# EasyEDA schematic ads1115-reference.easyeda.json

## Sheets
1 ADC logic: TITLE: Lunatic MIDI: ADC logic module; REV: 1.0; Date: 2019-02-11; Sheet: 1/1; Drawn By: Marco Zaccari
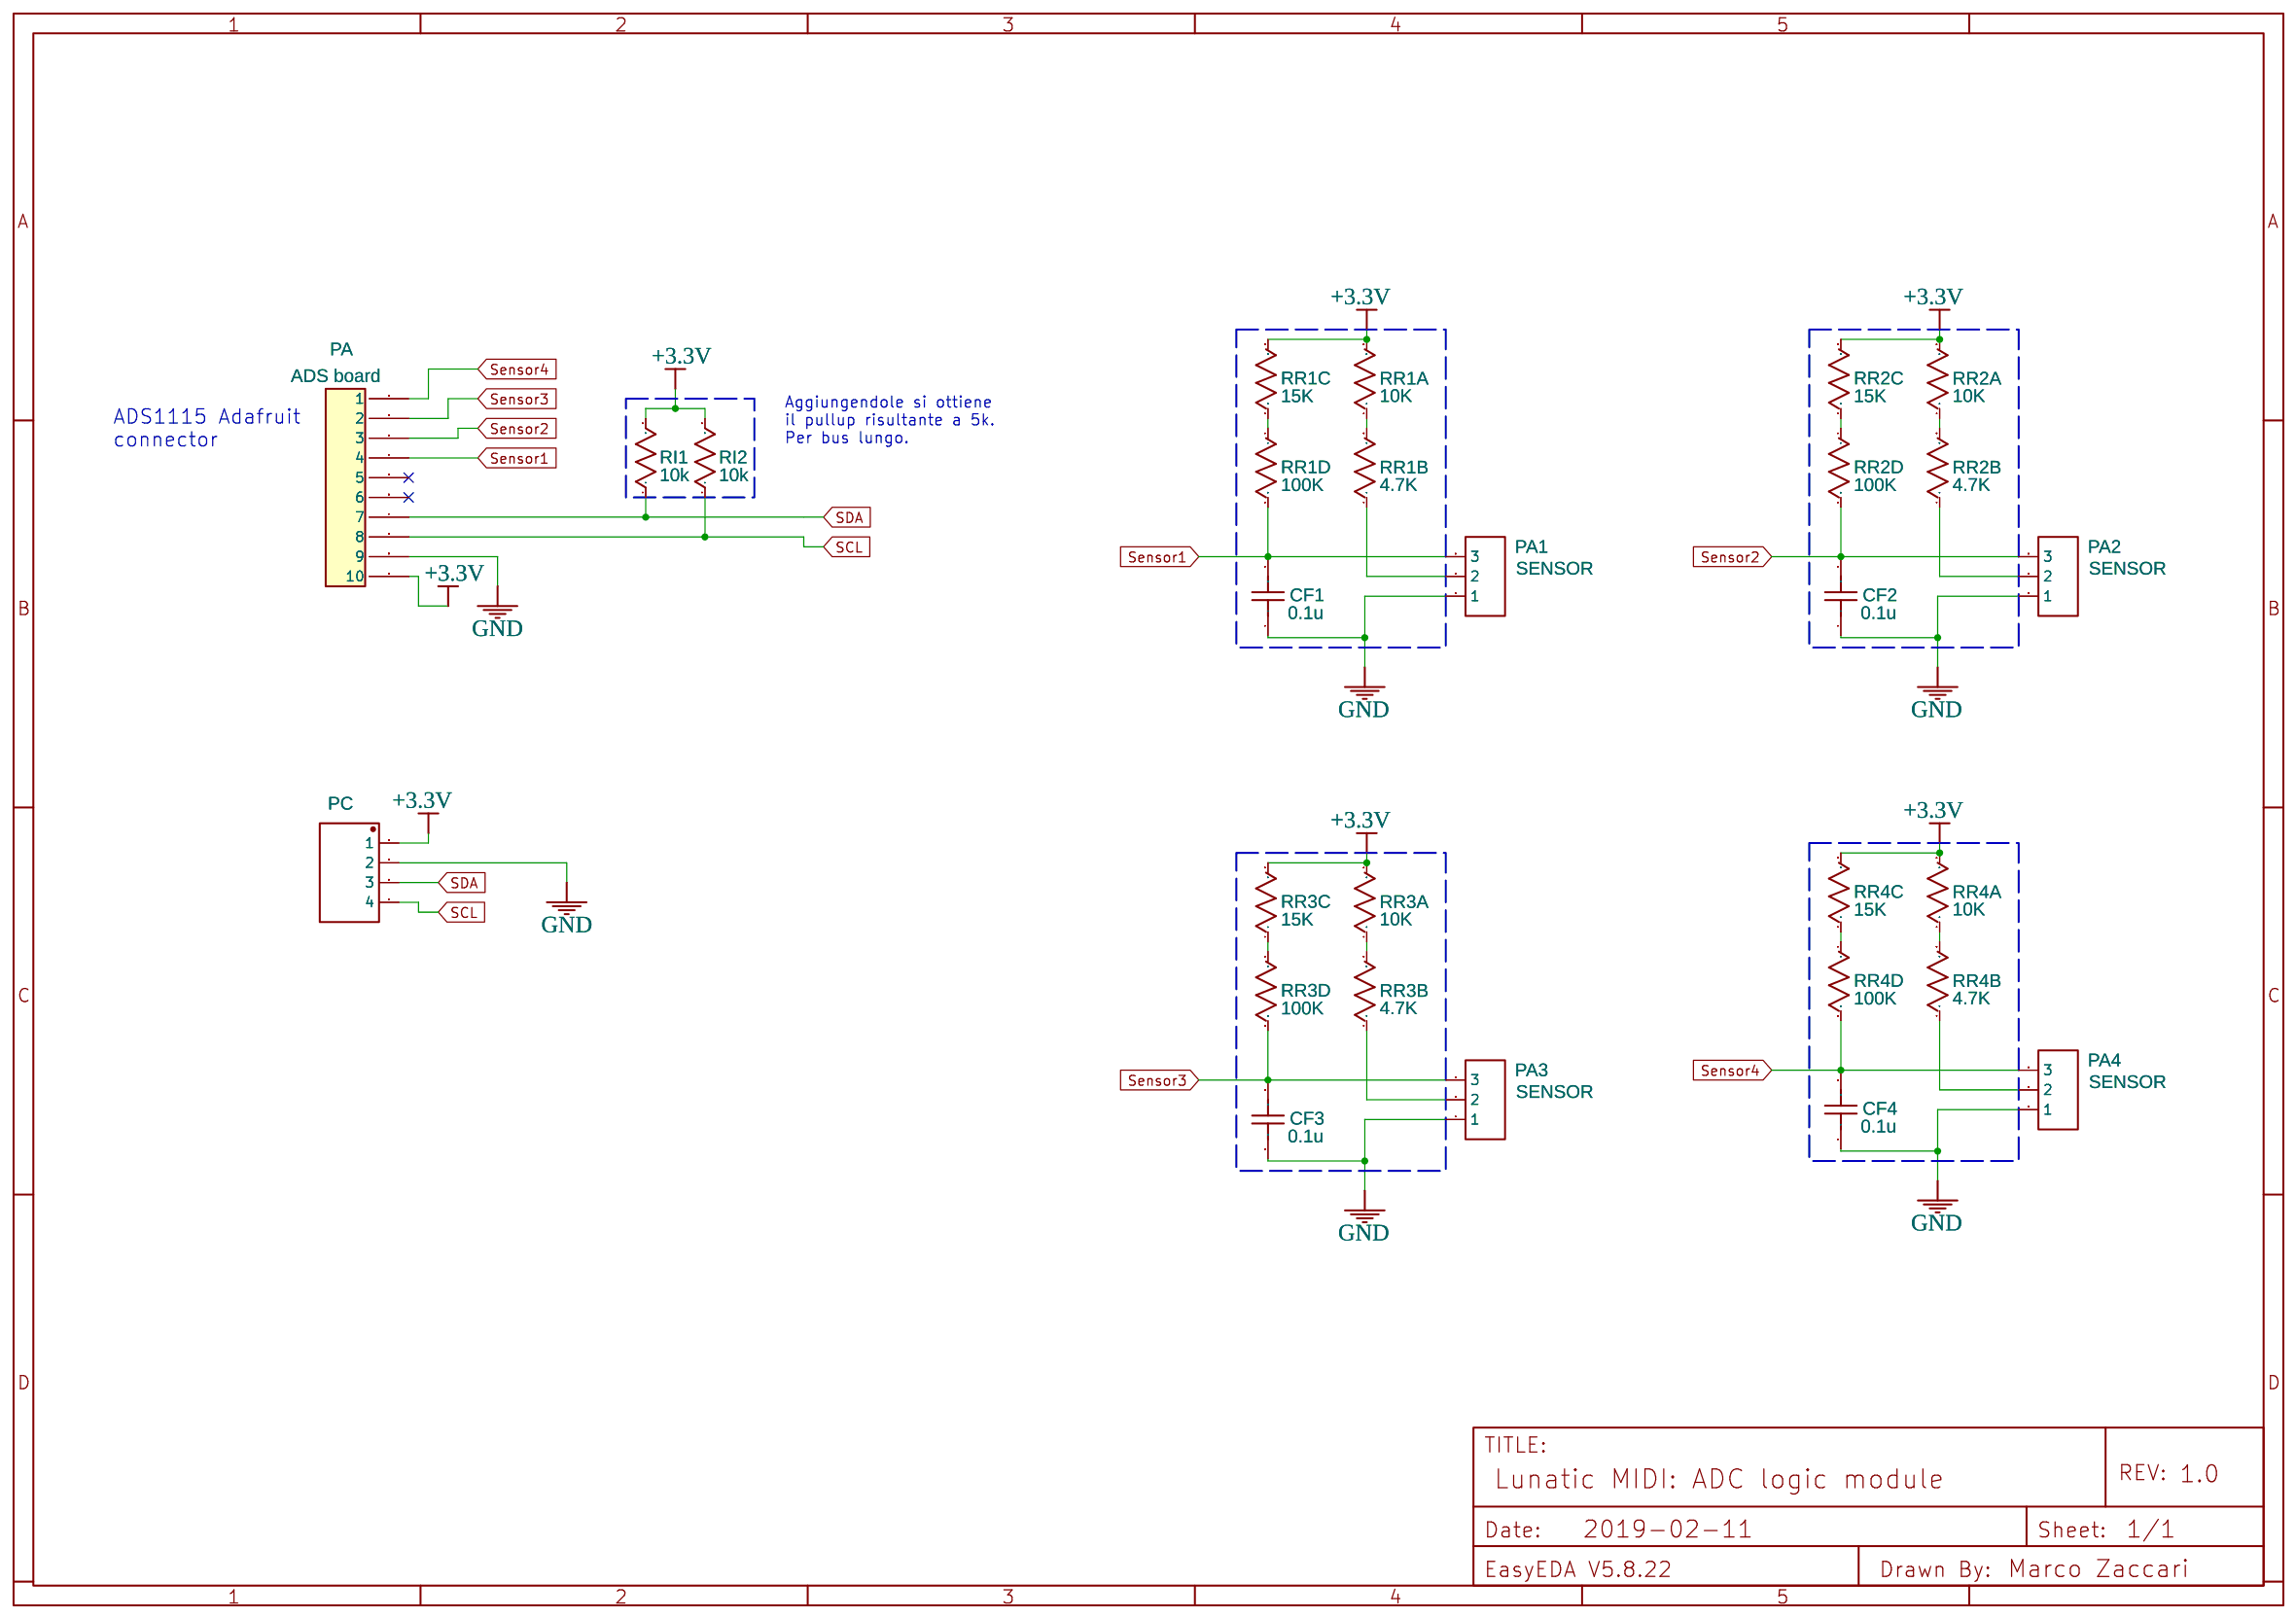
[diagram p0: ADC logic]
2 ADS1115 Adafruit and Ribbon (reference): TITLE: ADS1115 Adafruit and Ribbon reference; Date: 2021-04-03; Drawn By: Mark Zackie
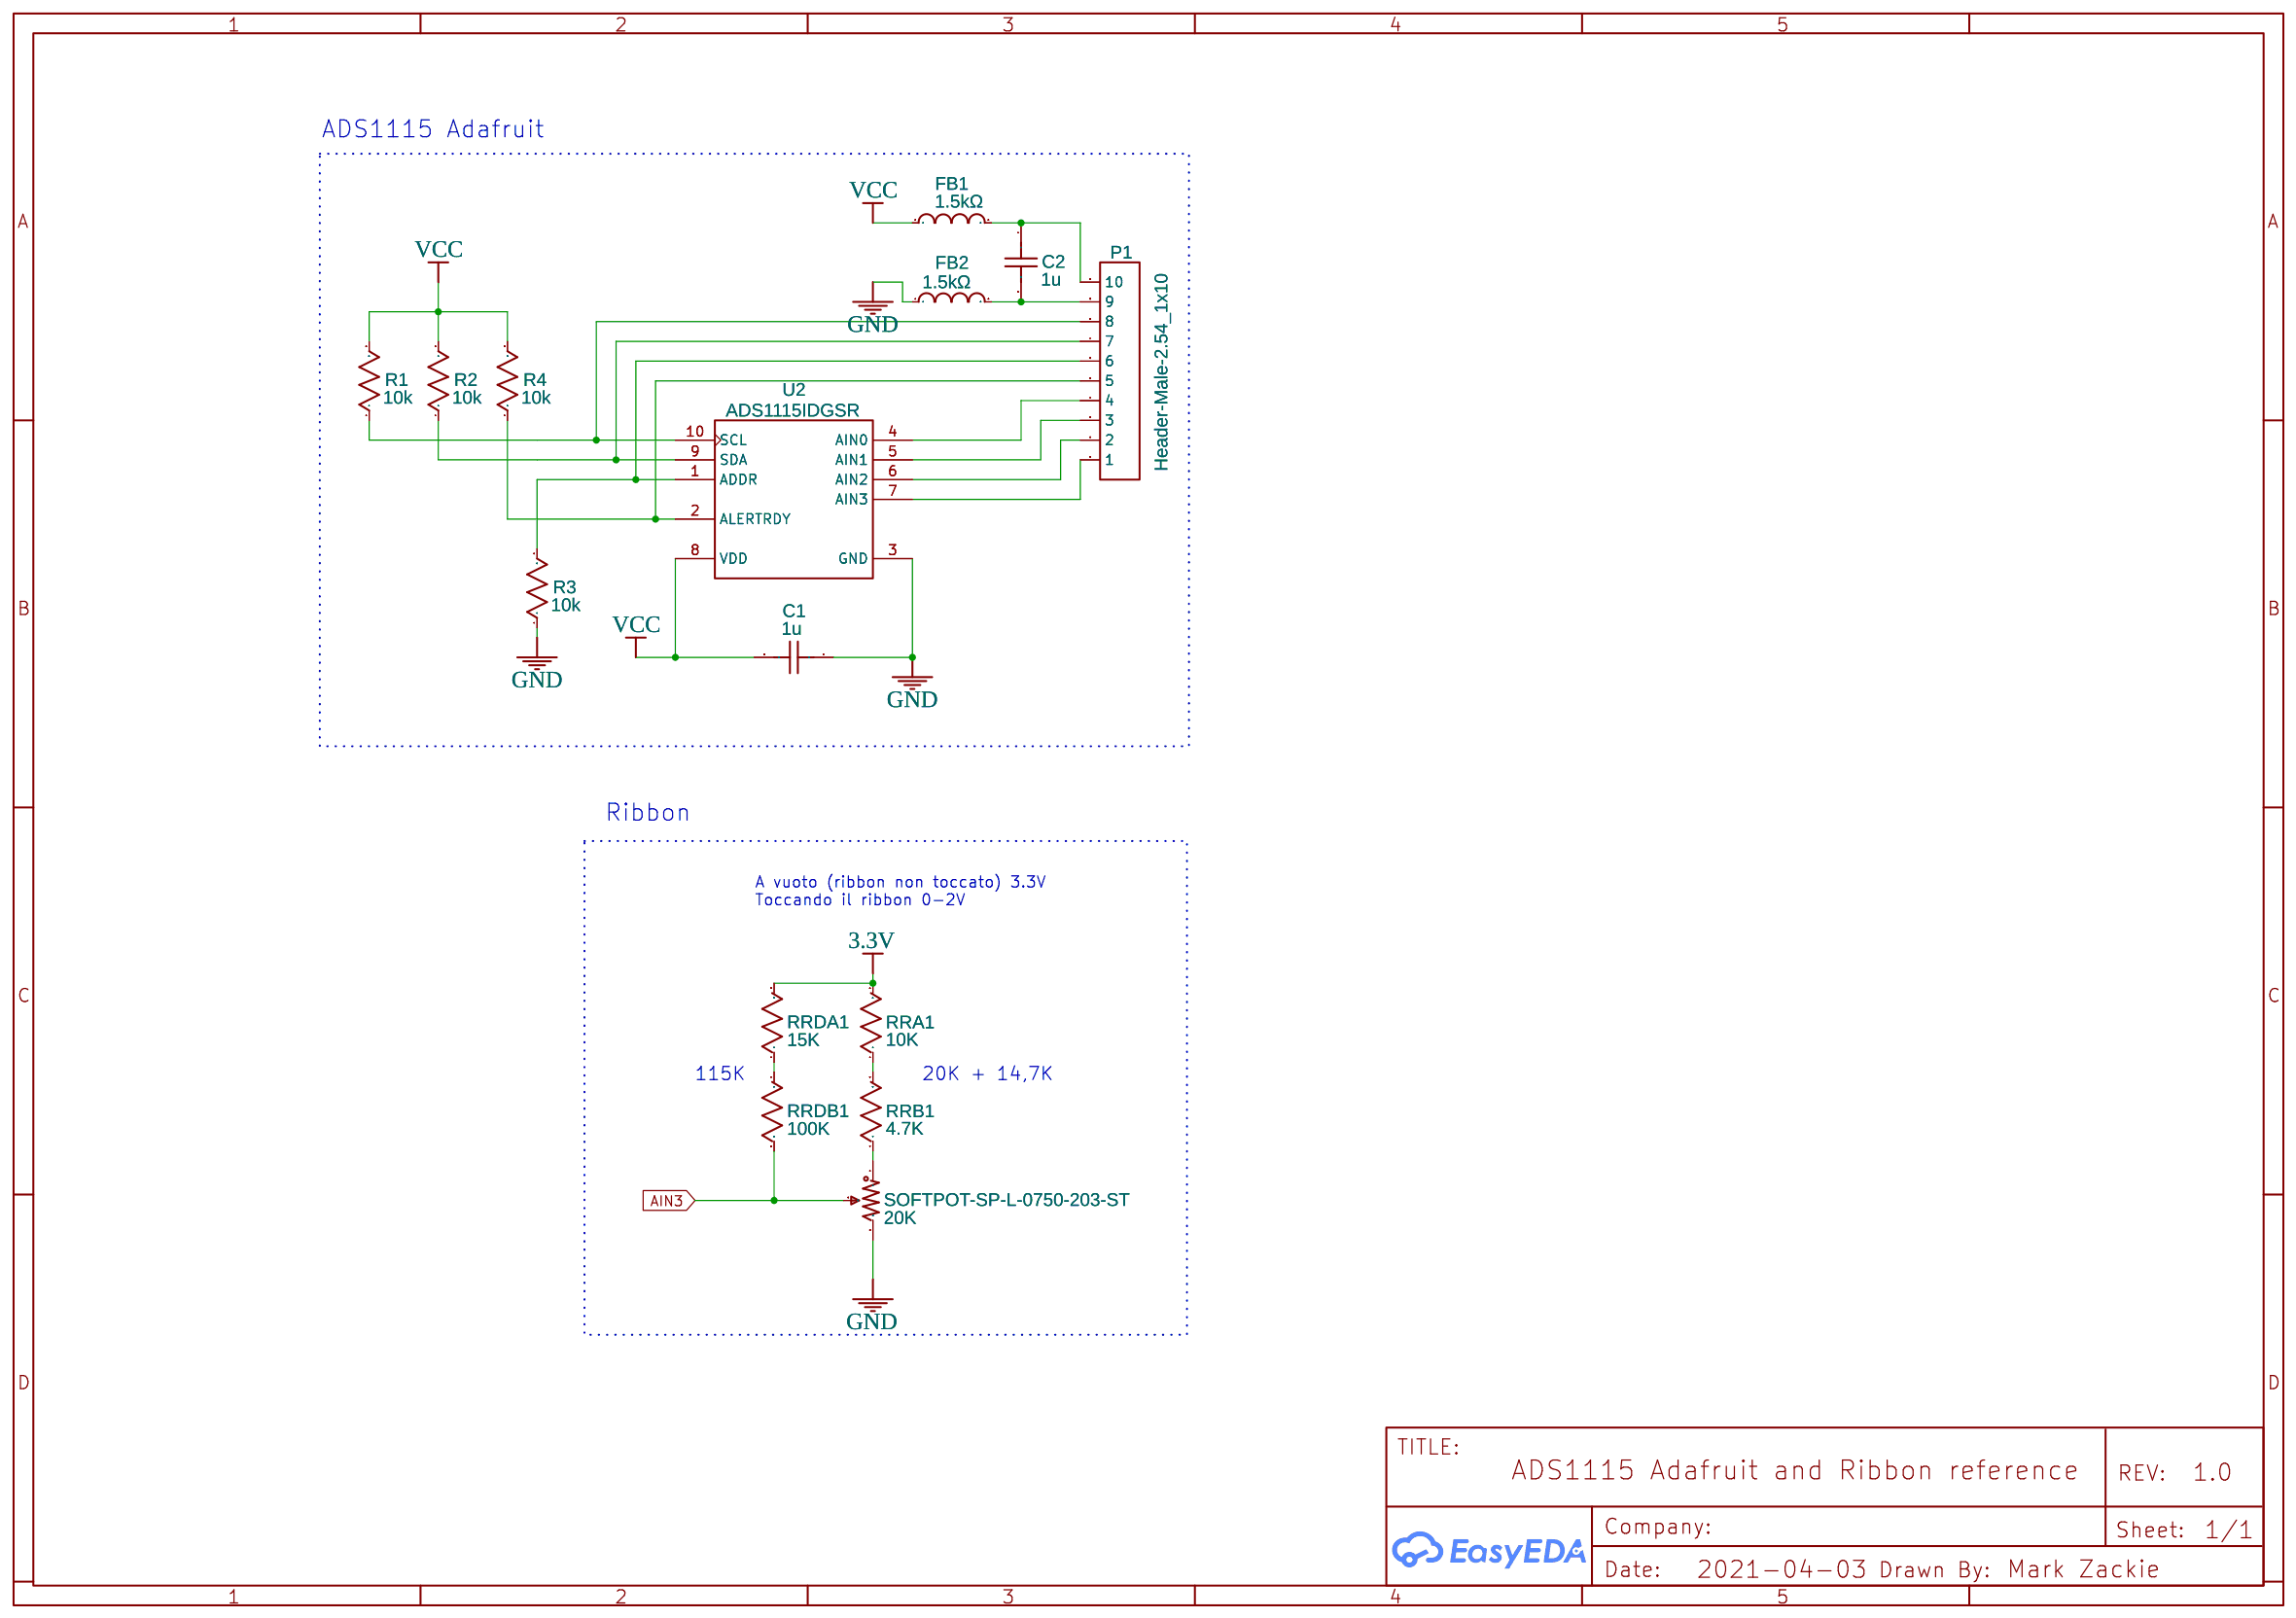
[diagram p1: ADS1115 Adafruit and Ribbon (reference)]

## Parts
sheet ADC logic
CF1  0.1u  [RAD-0.1]
CF2  0.1u  [RAD-0.1]
CF3  0.1u  [RAD-0.1]
CF4  0.1u  [RAD-0.1]
PA  ADS board  [HDR-10X1/1.27]
PA1  SENSOR  [HDR-3X1/2.54]
PA2  SENSOR  [HDR-3X1/2.54]
PA3  SENSOR  [HDR-3X1/2.54]
PA4  SENSOR  [HDR-3X1/2.54]
PC  Header-Male-2.54_1x4  [210S-1X4P]
RI1  10k  [AXIAL-0.3]
RI2  10k  [AXIAL-0.3]
RR1A  10K  [AXIAL-0.3]
RR1B  4.7K  [AXIAL-0.3]
RR1C  15K  [AXIAL-0.3]
RR1D  100K  [AXIAL-0.3]
RR2A  10K  [AXIAL-0.3]
RR2B  4.7K  [AXIAL-0.3]
RR2C  15K  [AXIAL-0.3]
RR2D  100K  [AXIAL-0.3]
RR3A  10K  [AXIAL-0.3]
RR3B  4.7K  [AXIAL-0.3]
RR3C  15K  [AXIAL-0.3]
RR3D  100K  [AXIAL-0.3]
RR4A  10K  [AXIAL-0.3]
RR4B  4.7K  [AXIAL-0.3]
RR4C  15K  [AXIAL-0.3]
RR4D  100K  [AXIAL-0.3]
sheet ADS1115 Adafruit and Ribbon (reference)
C1  1u  [RAD-0.1]
C2  1u  [RAD-0.1]
FB1  1.5kΩ  [0805]
FB2  1.5kΩ  [0805]
P1  Header-Male-2.54_1x10  [HDR-10X1/2.54]
R1  10k  [AXIAL-0.3]
R2  10k  [AXIAL-0.3]
R3  10k  [AXIAL-0.3]
R4  10k  [AXIAL-0.3]
RRA1  10K  [AXIAL-0.3]
RRB1  4.7K  [AXIAL-0.3]
RRDA1  15K  [AXIAL-0.3]
RRDB1  100K  [AXIAL-0.3]
SOFTPOT-SP-L-0750-203-ST  20K  [RES-ADJ_3386P]
U2  ADS1115IDGSR  [MSOP-10]

## Library data of the parts
C1 C2 CF1-CF4 = Cap_RAD-0.1_US: Manufacturer Part: ?
PA = -: Supplier: LCSC; Manufacturer: BOOMELE; Manufacturer Part: Header-Female-1.27_1x10; image: //image.lceda.cn/szlcsc/C29357.jpg; Supplier Part: C29357
PA1-PA4 = -: Supplier: LCSC; Manufacturer: BOOMELE; Manufacturer Part: Header2.54mm 1*3P; image: //image.lceda.cn/szlcsc/C49257.jpg; Supplier Part: C49257
PC = -: Supplier: LCSC; Manufacturer: Ckmtw; Manufacturer Part: 210S-1*4P L=11.6MMGold-plated black; Contributor: LCSC; Supplier Part: C124378
R1-R4 RI1 RI2 RR1A RR1B RR1C RR1D RR2A RR2B RR2C RR2D RR3A RR3B RR3C RR3D RR4A RR4B RR4C RR4D RRA1 RRB1 RRDA1 RRDB1 = Res_AXIAL-0.3(1/8W)_US: Manufacturer Part: ?
FB1 FB2 = MMZ2012Y152B: Supplier: LCSC; Manufacturer: TDK; Supplier Part: C21517
P1 = -: Supplier: LCSC; Manufacturer Part: Headers  Pins2.54mm1*10P; image: http://image.lceda.cn/szlcsc/C57369.jpg; Supplier Part: C57369
SOFTPOT-SP-L-0750-203-ST = 3386P-1-101LF_US: Supplier Part: C125022; Supplier: LCSC; Manufacturer: Bochen; Manufacturer Part: 3386P-1-101LF; Contributor: EasyEDA
U2 = -: Supplier: LCSC; Manufacturer: TI; Supplier Part: C37593

## Nets
3.3V: RRA1.2 RRDA1.2
+3.3V: PA.10 PC.1 RI1.2 RI2.2 RR1A.2 RR1C.2 RR2A.2 RR2C.2 RR3A.2 RR3C.2 RR4A.2 RR4C.2
GND: C1.1 CF1.1 CF2.1 CF3.1 CF4.1 FB2.1 PA.9 PA1.1 PA2.1 PA3.1 PA4.1 PC.2 R3.1 SOFTPOT-SP-L-0750-203-ST.3 U2.3(GND)
VCC: C1.2 FB1.1 R1.2 R2.2 R4.2 U2.8(VDD)
AIN3: RRDB1.2 SOFTPOT-SP-L-0750-203-ST.2
SCL: PA.8 PC.4 RI2.1
SDA: PA.7 PC.3 RI1.1
Sensor1: CF1.2 PA.4 PA1.3 RR1D.2
Sensor2: CF2.2 PA.3 PA2.3 RR2D.2
Sensor3: CF3.2 PA.2 PA3.3 RR3D.2
Sensor4: CF4.2 PA.1 PA4.3 RR4D.2
Net-(C2-1): C2.1 FB1.2 P1.10
Net-(C2-2): C2.2 FB2.2 P1.9
Net-(P1-1): P1.1 U2.7(AIN3)
Net-(P1-2): P1.2 U2.6(AIN2)
Net-(P1-3): P1.3 U2.5(AIN1)
Net-(P1-4): P1.4 U2.4(AIN0)
Net-(P1-5): P1.5 R4.1 U2.2(ALERTRDY)
Net-(P1-6): P1.6 R3.2 U2.1(ADDR)
Net-(P1-7): P1.7 R2.1 U2.9(SDA)
Net-(P1-8): P1.8 R1.1 U2.10(SCL)
Net-(PA1-2): PA1.2 RR1B.1
Net-(PA2-2): PA2.2 RR2B.1
Net-(PA3-2): PA3.2 RR3B.1
Net-(PA4-2): PA4.2 RR4B.1
Net-(RR1A-1): RR1A.1 RR1B.2
Net-(RR1C-1): RR1C.1 RR1D.1
Net-(RR2A-1): RR2A.1 RR2B.2
Net-(RR2C-1): RR2C.1 RR2D.1
Net-(RR3A-1): RR3A.1 RR3B.2
Net-(RR3C-1): RR3C.1 RR3D.1
Net-(RR4A-1): RR4A.1 RR4B.2
Net-(RR4C-1): RR4C.1 RR4D.1
Net-(RRA1-1): RRA1.1 RRB1.2
Net-(RRB1-1): RRB1.1 SOFTPOT-SP-L-0750-203-ST.1
Net-(RRDA1-1): RRDA1.1 RRDB1.1

Not connected (* = marked no-connect by the designer): PA 5* 6*

## Notes on the sheets
sheet 1
- Aggiungendole si ottiene
  il pullup risultante a 5k.
  Per bus lungo.
- ADS1115 Adafruit
  connector
sheet 2
- ADS1115 Adafruit
- Ribbon
- A vuoto (ribbon non toccato) 3.3V
  Toccando il ribbon 0-2V
- 115K
- 20K + 14,7K
